# EAGLE design BME680 (EAGLE 8.7.1)
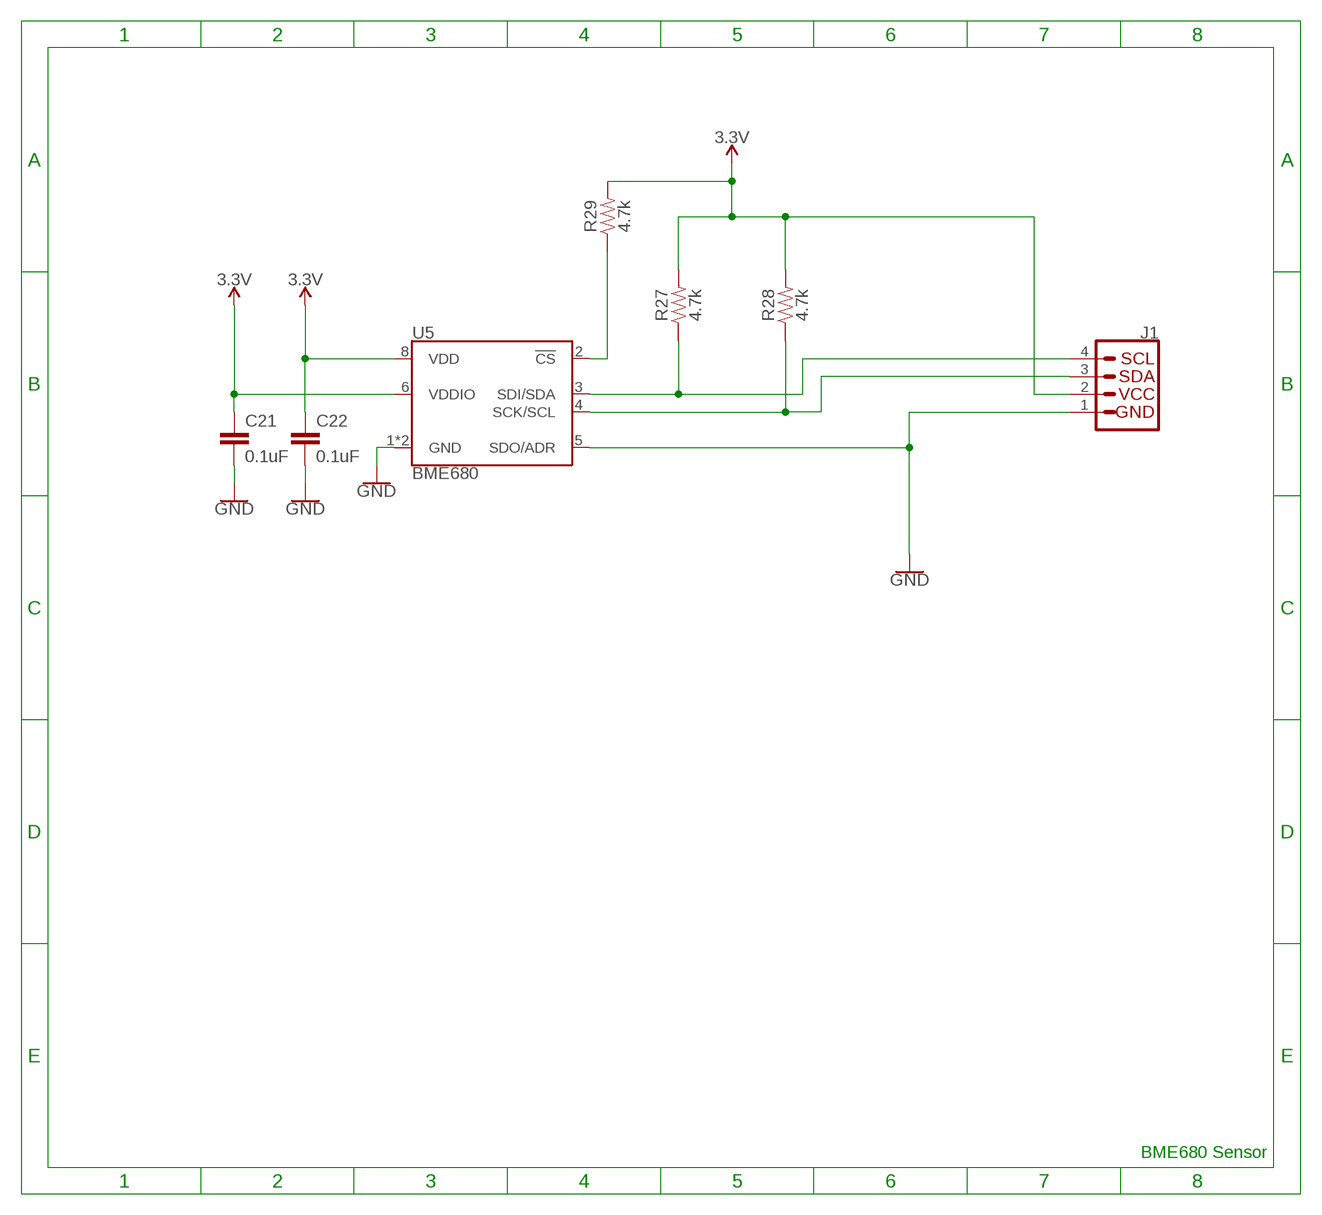
[diagram p0: schematic, sheet 1]

## Parts
C21  0.1uF  0.1UF-0603-100V-10%  [0603]
C22  0.1uF  0.1UF-0603-100V-10%  [0603]
J1  QWIIC_CONNECTORJS-1MM  [1X04_1MM_RA@1]
R27  4.7k  4.7KOHM-0603-1/10W-1%  [0603]
R28  4.7k  4.7KOHM-0603-1/10W-1%  [0603]
R29  4.7k  4.7KOHM-0603-1/10W-1%  [0603]
U5  BME680  [BME680]

## Nets
3.3V: C21.1 C22.1 J1.2 R27.2 R28.2 R29.2 U5.6(VDDIO) U5.8(VDD)
!CS: R29.1 U5.2(!CS)
GND: C21.2 C22.2 J1.1 U5.1(GND) U5.5(SDO/ADR) U5.7(GND)
SCK/SCL: J1.3 R28.1 U5.4(SCK/SCL)
SDI/SDA: J1.4 R27.1 U5.3(SDI/SDA)

## Notes on the sheet
- BME680 Sensor

## Library data of the parts
C21 C22 = SparkFun-Capacitors:0.1UF: 0.1µF ceramic capacitors A capacitor is a passive two-terminal electrical component used to store electrical energy temporarily in an electric field.; PROD_ID: CAP-08390
J1 = SparkFun-Connectors:QWIIC_CONNECTOR: SparkFun I2C Standard Qwiic Connector An SMD 1mm pitch JST connector makes it easy and quick (get it? Qwiic?) to connect I2C devices to each other. The Qwiic system <http://www.sparkfun.com/qwiic> enables fast and solderless connection between popular platforms and various sensors and actuators. We carry 200mm <https://www.sparkfun.com/products/14204>, 100mm <https://www.sparkfun.com/products/14205>, 50mm <https://www.sparkfun.com/products/14206>, and breadboard friendly <https://www.sparkfun.com/products/14207> Qwiic cables. We also offer 10 pcs strips <https://www.sparkfun.com/products/14323> the SMD connectors.; PROD_ID: CONN-13694
R27-R29 = SparkFun-Resistors:4.7KOHM: 4.7kΩ resistor A resistor is a passive two-terminal electrical component that implements electrical resistance as a circuit element. Resistors act to reduce current flow, and, at the same time, act to lower voltage levels within circuits. - Wikipedia; PROD_ID: RES-07857
U5 = BME680:BME680

## Board
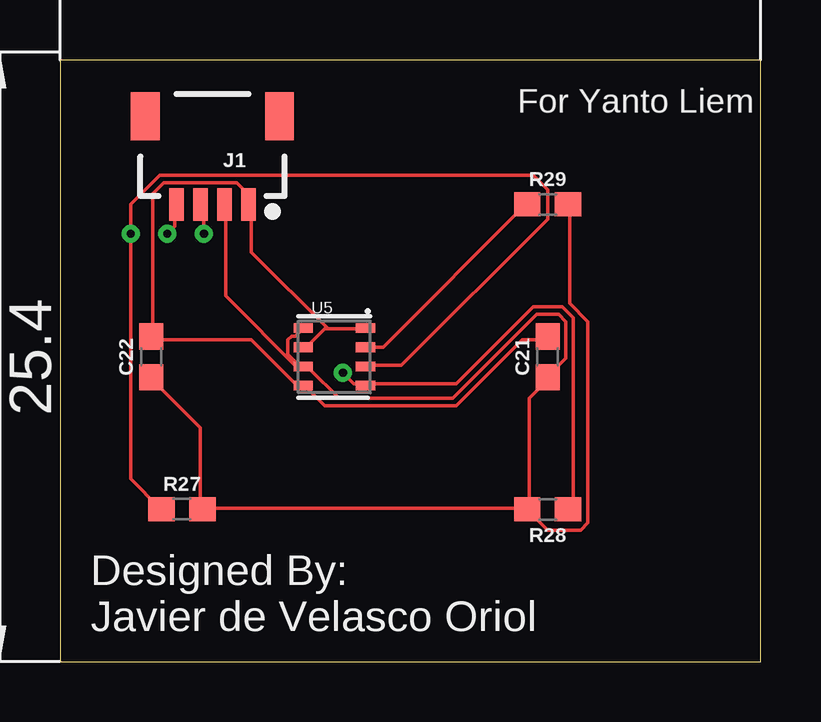
[diagram p1: board, top side]
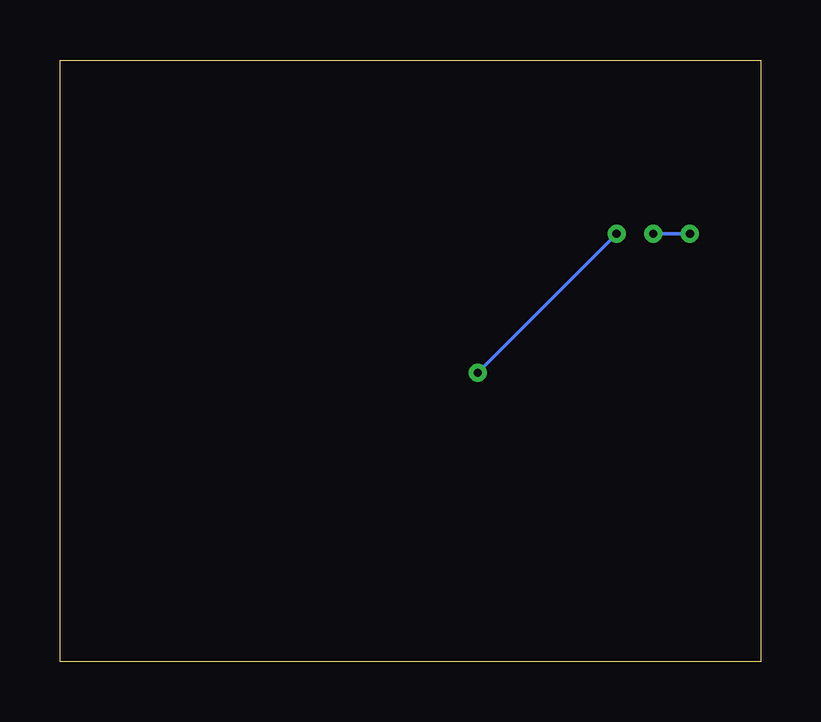
[diagram p2: board, bottom side, seen from below]

Size 29.19 x 25.07 mm. Coordinates in mm from the lower left corner, seen from the top.
Outline: 0,0 29.19,0 29.19,25.07 0,25.07 0,0
Copper layers (1*16): Top 0.035mm / dielectric 1.5mm / Bottom 0.035mm
Design rules "default": minimum track width 6mil, minimum drill 0.35mm, track to track 6mil, track to pad 6mil, pad to pad 6mil, via to via 6mil, smd to smd 6mil, copper to edge 40mil, drill to drill 6mil, minimum pad ring 10mil, minimum via ring 8mil, stop-mask expansion 4mil, vias tented up to drill 0mil, thermal gap 10mil

### Footprints (pad centres in the part's own frame; a part is rotated, then mirrored left to right if it is on the bottom)
0603 = smd 1.1 x 1: 1 -0.85,0; 2 0.85,0
1X04_1MM_RA@1 = smd 0.6 x 1.35: 1 -1.5,0; 2 -0.5,0; 3 0.5,0; 4 1.5,0 | smd 1.2 x 2: NC1 2.8,-3.675; NC2 -2.8,-3.675
BME680 = smd 0.8 x 0.4: 1 1.3,1.2; 2 1.3,0.4; 3 1.3,-0.4; 4 1.3,-1.2; 5 -1.3,-1.2; 6 -1.3,-0.4; 7 -1.3,0.4; 8 -1.3,1.2

### Placement (x,y rotation side)
C21  20.32,12.7 90 top
C22  3.81,12.7 90 top
J1  6.35,19.05 180 top
R27  5.08,6.35 0 top
R28  20.32,6.35 180 top
R29  20.32,19.05 0 top
U5  11.43,12.7 0 top

### Tracks (layer width: path | path; a pad name or v marks a point on that pad's centre or on a via)
3.3V
  Top 0.152: C22.1 3.86,11.73 5.84,9.75 5.84,6.4 R27.2 5.99,6.4 19.41,6.4 R28.2 | R28.2 19.56,6.4 19.56,10.97 20.32,11.73 C21.1 20.32,11.89 21.08,12.65 21.08,14.17 20.78,14.48 19.86,14.48 16.36,10.97 11.63,10.97 10.41,12.19 10.26,12.19 U5.6 10.11,12.19 | R29.2 21.23,19.05 21.23,14.93 22,14.17 22,5.79 21.69,5.49 20.32,5.49 19.56,6.25 R28.2 | 10.11,12.19 9.5,12.8 9.5,13.41 9.65,13.56 9.8,13.56 10.11,13.87 U5.8 | 10.11,12.19 9.96,12.19 6.91,15.24 6.91,19.05 J1.2
!CS
  Top 0.152: U5.2 12.85,13.11 13.46,13.11 19.41,19.05 R29.1
GND
  Top 0.152: 11.18,13.87 11.02,13.87 10.26,13.11 U5.7 | 11.18,13.87 12.7,13.87 U5.1 | C21.2 20.32,13.41 19.25,13.41 16.51,10.67 11.02,10.67 10.26,11.43 U5.5 10.11,11.58 9.8,11.58 7.98,13.41 3.86,13.41 C22.2 3.86,13.56 3.86,19.51 4.32,19.96 7.37,19.96 7.82,19.51 7.82,19.05 J1.1 7.98,19.05 7.98,17.07 11.18,13.87
SCK/SCL  (via drill 0.35)
  Top 0.152: R28.1 21.23,6.4 21.39,6.55 21.39,14.33 20.93,14.78 19.71,14.78 16.51,11.58 12.85,11.58 U5.4 12.7,11.58 12.24,11.58 v11.79,12.04 | v5.99,17.83 5.99,19.05 J1.3
  Bottom 0.152: v11.79,12.04 v5.99,17.83
SDI/SDA  (via drill 0.35)
  Top 0.152: U5.3 12.85,12.34 14.22,12.34 20.32,18.44 20.32,19.66 19.71,20.27 4.17,20.27 2.95,19.05 v2.95,17.83 2.95,7.62 4.17,6.4 R27.1 | v4.47,17.83 4.77,18.14 4.77,19.05 J1.4
  Bottom 0.152: v2.95,17.83 v4.47,17.83

### Text on the board
tNames: For Yanto Liem | Designed By: / Javier de Velasco Oriol